# Altium project esp32c3_devboard.PrjPcb
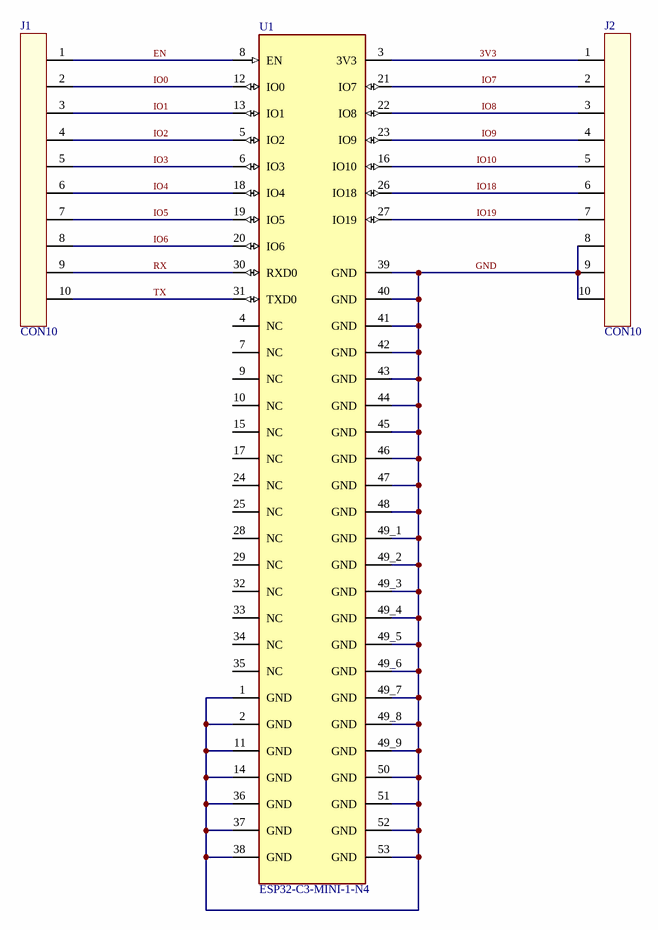
[diagram p0: esp32c2_devboard.SchDoc]
1 sheet, 3 parts. Net scope: global (net labels, ports and power ports of the same name join across sheets).
Board file: esp32c2_devboard.PcbDoc

## Sheet esp32c2_devboard.SchDoc
size 290 x 209 mm

### Parts
J1  CON10  [CON10]
J2  CON10  [CON10]
U1  ESP32-C3-MINI-1-N4  [XCVR_ESP32-C3-MINI-1-N4]

### Nets
3V3: J2.1 U1.3(3V3)
EN: J1.1 U1.8(EN)
GND: J2.8 J2.9 J2.10 U1.1(GND) U1.2(GND) U1.11(GND) U1.14(GND) U1.36(GND) U1.37(GND) U1.38(GND) U1.39(GND) U1.40(GND) U1.41(GND) U1.42(GND) U1.43(GND) U1.44(GND) U1.45(GND) U1.46(GND) U1.47(GND) U1.48(GND) U1.49_1(GND) U1.49_2(GND) U1.49_3(GND) U1.49_4(GND) U1.49_5(GND) U1.49_6(GND) U1.49_7(GND) U1.49_8(GND) U1.49_9(GND) U1.50(GND) U1.51(GND) U1.52(GND) U1.53(GND)
IO0: J1.2 U1.12(IO0)
IO1: J1.3 U1.13(IO1)
IO2: J1.4 U1.5(IO2)
IO3: J1.5 U1.6(IO3)
IO4: J1.6 U1.18(IO4)
IO5: J1.7 U1.19(IO5)
IO6: J1.8 U1.20(IO6)
IO7: J2.2 U1.21(IO7)
IO8: J2.3 U1.22(IO8)
IO9: J2.4 U1.23(IO9)
IO10: J2.5 U1.16(IO10)
IO18: J2.6 U1.26(IO18)
IO19: J2.7 U1.27(IO19)
RX: J1.9 U1.30(RXD0)
TX: J1.10 U1.31(TXD0)

Not connected (* = marked no-connect by the designer): U1 4(NC) 7(NC) 9(NC) 10(NC) 15(NC) 17(NC) 24(NC) 25(NC) 28(NC) 29(NC) 32(NC) 33(NC) 34(NC) 35(NC)

### Library data of the parts
U1 = ESP32-C3-MINI-1-N4: Bluetooth, WiFi 802.11b/g/n, Bluetooth v5.0 Transceiver Module 2.412GHz ~ 2.484GHz PCB Trace Surface Mount; MF: Espressif Systems; SnapEDA_Link: https://www.snapeda.com/parts/ESP32-C3-MINI-1-N4/Espressif+Systems/view-part/?ref=snap; Package: SMD-53 Espressif Systems; MP: ESP32-C3-MINI-1-N4; Check_prices: https://www.snapeda.com/parts/ESP32-C3-MINI-1-N4/Espressif+Systems/view-part/?ref=eda; Purchase-URL: https://pricing.snapeda.com/search/part/ESP32-C3-MINI-1-N4/?ref=eda; Price: None; Value: *; Availability: In Stock